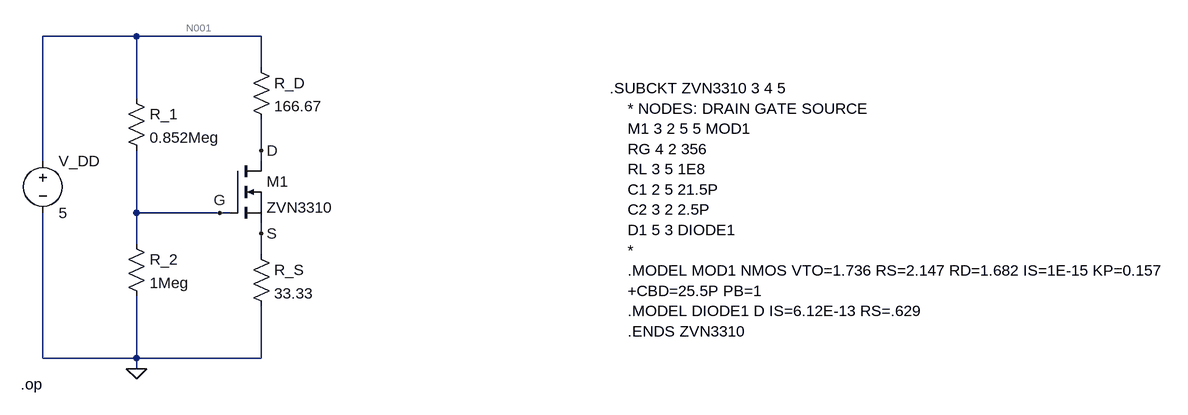
[diagram p0: schematic 12.asc]
12.asc, the LTspice schematic file:
Version 4
SHEET 1 1648 680
WIRE 16 -80 -128 -80
WIRE 208 -80 16 -80
WIRE 208 -32 208 -80
WIRE 16 16 16 -80
WIRE 208 96 208 48
WIRE -128 112 -128 -80
WIRE 208 112 208 96
WIRE 16 192 16 96
WIRE 144 192 16 192
WIRE 160 192 144 192
WIRE 208 224 208 208
WIRE 16 240 16 192
WIRE 208 256 208 224
WIRE -128 416 -128 192
WIRE 16 416 16 320
WIRE 16 416 -128 416
WIRE 208 416 208 336
WIRE 208 416 16 416
WIRE 16 432 16 416
FLAG 16 432 0
FLAG 144 192 G
FLAG 208 224 S
FLAG 208 96 D
SYMBOL nmos 160 112 R0
SYMATTR InstName M1
SYMATTR Value ZVN3310
SYMATTR Prefix X
SYMBOL res 192 240 R0
SYMATTR InstName R_S
SYMATTR Value 33.33
SYMBOL res 192 -48 R0
SYMATTR InstName R_D
SYMATTR Value 166.67
SYMBOL res 0 0 R0
SYMATTR InstName R_1
SYMATTR Value 0.852Meg
SYMBOL res 0 224 R0
SYMATTR InstName R_2
SYMATTR Value 1Meg
SYMBOL voltage -128 96 R0
WINDOW 123 0 0 Left 0
WINDOW 39 0 0 Left 0
SYMATTR InstName V_DD
SYMATTR Value 5
TEXT 744 0 Left 2 !.SUBCKT ZVN3310 3 4 5\n    * NODES: DRAIN GATE SOURCE\n    M1 3 2 5 5 MOD1   \n    RG 4 2 356\n    RL 3 5 1E8\n    C1 2 5 21.5P\n    C2 3 2 2.5P \n    D1 5 3 DIODE1\n    *\n    .MODEL MOD1 NMOS VTO=1.736 RS=2.147 RD=1.682 IS=1E-15 KP=0.157\n    +CBD=25.5P PB=1\n    .MODEL DIODE1 D IS=6.12E-13 RS=.629\n    .ENDS ZVN3310
TEXT -162 456 Left 2 !.op

The netlist it stands for:
* 12.asc
XM1 D G S ZVN3310  ; pins D G S
R_S S 0 33.33
R_D N001 D 166.67
R_1 N001 G 0.852Meg
R_2 G 0 1Meg
V_DD N001 0 5
.SUBCKT ZVN3310 3 4 5
    * NODES: DRAIN GATE SOURCE
    M1 3 2 5 5 MOD1
    RG 4 2 356
    RL 3 5 1E8
    C1 2 5 21.5P
    C2 3 2 2.5P
    D1 5 3 DIODE1
    *
    .MODEL MOD1 NMOS VTO=1.736 RS=2.147 RD=1.682 IS=1E-15 KP=0.157
    +CBD=25.5P PB=1
    .MODEL DIODE1 D IS=6.12E-13 RS=.629
    .ENDS ZVN3310
.op
.backanno
.end

* Results of the author's LTspice run, read from the files saved beside the schematic
* Operating Point:
*   V(d) = 2.518 V
*   V(s) = 496.3 mV
*   V(g) = 2.7 V
*   V(n001) = 5 V
*   I(R_s) = 14.89 mA
*   I(R_d) = 14.89 mA
*   I(R_1) = 2.7 µA
*   I(R_2) = 2.7 µA
*   I(V_dd) = -14.89 mA
*   Ix(m1:3) = 14.89 mA
*   Ix(m1:4) = 0 A
*   Ix(m1:5) = -14.89 mA
* From the log:
*   Semiconductor Device Operating Points:
*                           --- Diodes ---
*   Name:    d:m1:1
*   Model:  m1:diode1
*   Id:     -2.63e-12
*   Vd:     -2.02e+00
*   Req:     1.00e+12
*   CAP:     0.00e+00
*                           --- MOSFET Transistors ---
*   Name:        m:m1:1
*   Model:       m1:mod1
*   Id:          1.49e-02
*   Vgs:         2.20e+00
*   Vds:         2.02e+00
*   Vbs:         0.00e+00
*   Vth:         1.74e+00
*   Vdsat:       4.36e-01
*   Gm:          6.84e-02
*   Gds:         0.00e+00
*   Gmb:         0.00e+00
*   Cbd:         1.47e-11
*   Cbs:         0.00e+00
*   Cgsov:       0.00e+00
*   Cgdov:       0.00e+00
*   Cgbov:       0.00e+00
*   Cgs:         0.00e+00
*   Cgd:         0.00e+00
*   Cgb:         0.00e+00